# Altium schematic sheet ZOWI_Main_Board_Battery_Charger.SchDoc: Battery_Charger
size A4; Date: 20140218; Author: Raúl de Pablos; CompanyName: bq - Mundo Reader; Organization: bq - Mundo Reader; DocumentNumber: 4; Revision: 1.0; SheetNumber: 4; SheetTotal: 9; ProjectName: ZOWI_Main_Board
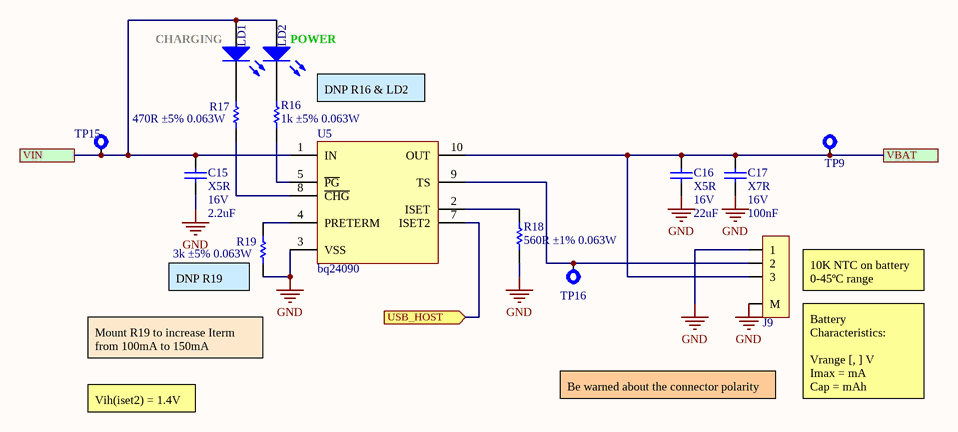
[diagram p0: ZOWI_Main_Board_Battery_Charger.SchDoc]

## Parts
C15  Dielectric: X5R  Voltage: 16V  Capacitance: 2.2uF  [C0603]  (hidden comment: Capacitor)
C16  Dielectric: X5R  Voltage: 16V  Capacitance: 22uF  [C0805]  (hidden comment: Capacitor)
C17  Dielectric: X7R  Voltage: 16V  Capacitance: 100nF  [C0402]  (hidden comment: Capacitor)
J9  S3B-PH-SM4-TB  [S3B-PH-SM4-TB]  (value not drawn)
LD1  Red  [LED_SMD_RA]  (value not drawn)
LD2  Green  [LED0603]  (value not drawn)  (no BOM)
R16  value 1k ±5% 0.063W  [R0402]  (hidden comment: Resistor)  (no BOM)
R17  value 470R ±5% 0.063W  [R0402]  (hidden comment: Resistor)
R18  value 560R ±1% 0.063W  [R0402]  (hidden comment: Resistor)
R19  value 3k ±5% 0.063W  [R0402]  (hidden comment: Resistor)  (no BOM)
TP9  Testpoint  [TP_SMD_1mm]  (value not drawn)  (no BOM)
TP15  Testpoint  [TP_SMD_1mm]  (value not drawn)  (no BOM)
TP16  Testpoint  [TP_SMD_1mm]  (value not drawn)  (no BOM)
U5  bq24090  [MSOP-10_5x3MM]

## Ports
USB_HOST (in), VBAT, VIN

## Nets
GND: C15.1 C16.1 C17.1 J9.1 J9.M R18.1 R19.1 U5.3(VSS)
USB_HOST: U5.7(ISET2) ; port USB_HOST
VBAT: C16.2 C17.2 J9.3 TP9.1 U5.10(OUT) ; port VBAT
VIN: C15.2 LD1.A LD2.A TP15.1 U5.1(IN) ; port VIN
NetJ9_2: J9.2 TP16.1 U5.9(TS)
NetLD1_K: LD1.K R17.2
NetLD2_K: LD2.K R16.2
NetR16_1: R16.1 U5.5(~{PG})
NetR17_1: R17.1 U5.8(~{CHG})
NetR18_2: R18.2 U5.2(ISET)
NetR19_2: R19.2 U5.4(PRETERM)

## Notes on the sheet
- (near LD1) CHARGING
- (near LD2) POWER
- DNP R16 & LD2
- (near R19) DNP R19
- (near J9) 10K NTC on battery
  0-45ºC range
- Vih(iset2) = 1.4V
- Mount R19 to increase Iterm from 100mA to 150mA
- Be warned about the connector polarity
- (near J9) Battery Characteristics:
  Vrange [, ] V
  Imax = mA
  Cap = mAh
- Title
- Project
- Size:
- Author
- A4
- Number:
- Revision:
- Mundo Reader, S.L. All rights reserved. No part of these pages, either text or image may be used for any purpose other than personal use. Therefore, reproduction, modification, storage in a retrieval system or retransmission, in any form or by any means, electronic, mechanical or otherwise, for reasons other than personal use, is strictly prohibited without prior written permission.
- Date:
- Time:
- Sheet
- of

## Library data of the parts
C15 = C0603_2.2uF_16V_±10%: Capacitor SMD; Manufacturer: Kemet; Value: 2.2uF ±10% 16V; Tolerance: ±10%; OrderingCode: C0603C225K4PAC; Temp_ Max: 125; Temp_ Min: -55; Part Number: C0603_2.2uF_16V_±10%
C16 = C0805_22uF_16V_±10%: Capacitor SMD; Part Number: C0805_22uF_16V_±20%; Manufacturer: Murata; Value: 22uF ±20% 16V; Tolerance: ±20%; OrderingCode: GRM219R61C226ME15K; Temp_ Max: 85; Temp_ Min: -55
C17 = C0402_100nF_16V_±10%: Capacitor SMD; Manufacturer: Kemet; Value: 100nF ±10% 16V; Tolerance: ±10%; OrderingCode: C0402C104K4RAC; Temp_ Max: 125; Temp_ Min: -55; Part Number: C0402_100nF_16V_±10%
J9 = 1x3 S3B-PH-SM4-TB: 1x3 PH connector; Manufacturer: JST; Current: 2A AWG#24; Temp_ Max: 85; Temp_ Min: -25; Part Number: 1x3 S3B-PH-SM4-TB; OrderingCode: S3B-PH-SM4-TB
LD1 = LED RED RIGHT ANGLE: LED; Manufacturer: KingBright; OrderingCode: APA3010SURCK; Temp_ Max: 85; Temp_ Min: -40; Part Number: LED RED RIGHT ANGLE; Value: Red
LD2 = HSMG-C190: LED; Manufacturer: Avago Technologies; Temp_ Max: 85; Temp_ Min: -40; OrderingCode 2: LG Q971-KN-1; Part Number: HSMG-C190; OrderingCode: HSMG-C190; Manufacturer 2: OSRAM Opto; Value: Green
R16 = R0402_1k_0.063W_±5%: Resistor, SMD; Manufacturer: Vishay; Tolerance: ±5%; OrderingCode: CRCW04021K00JN; Power: 0.063W; Resistance: 1k; Temp_ Max: 155; Temp_ Min: -55; PackageDescription: SMD; Part Number: R0402_1k_0.063W_±5%
R17 = R0402_470R_0.063W_±5%: Resistor, SMD; Manufacturer: Vishay; Tolerance: ±5%; OrderingCode: CRCW0402470RJN; Power: 0.063W; Resistance: 470R; Temp_ Max: 155; Temp_ Min: -55; PackageDescription: SMD; Part Number: R0402_470R_0.063W_±5%
R18 = R0402_560R_0.063W_±1%: Resistor, SMD; Manufacturer: Vishay; Tolerance: ±1%; OrderingCode: CRCW0402560RFK; Power: 0.063W; Resistance: 560R; Temp_ Max: 155; Temp_ Min: -55; PackageDescription: SMD; Part Number: R0402_560R_0.063W_±1%
R19 = R0402_3k_0.063W_±5%: Resistor, SMD; Manufacturer: Vishay; Tolerance: ±5%; OrderingCode: CRCW04023K00JN; Power: 0.063W; Resistance: 3k; Temp_ Max: 155; Temp_ Min: -55; PackageDescription: SMD; Part Number: R0402_3k_0.063W_±5%
TP9 TP15 TP16 = TP_SMD_1mm: Manufacturer: Oxley; OrderingCode: SMOX/060/B1; SAP: 303552; Part Number: TP_SMD_1mm
U5 = bq24090: Battery Charger, Li-Po/Li-ion, Single Cell; Manufacturer: Texas Instruments; OrderingCode: BQ24090DGQR; Temp_ Max: 85; Temp_ Min: -40; Part Number: bq24090